# EAGLE design bmi088_proj_dgnfly (EAGLE 9.6.2)
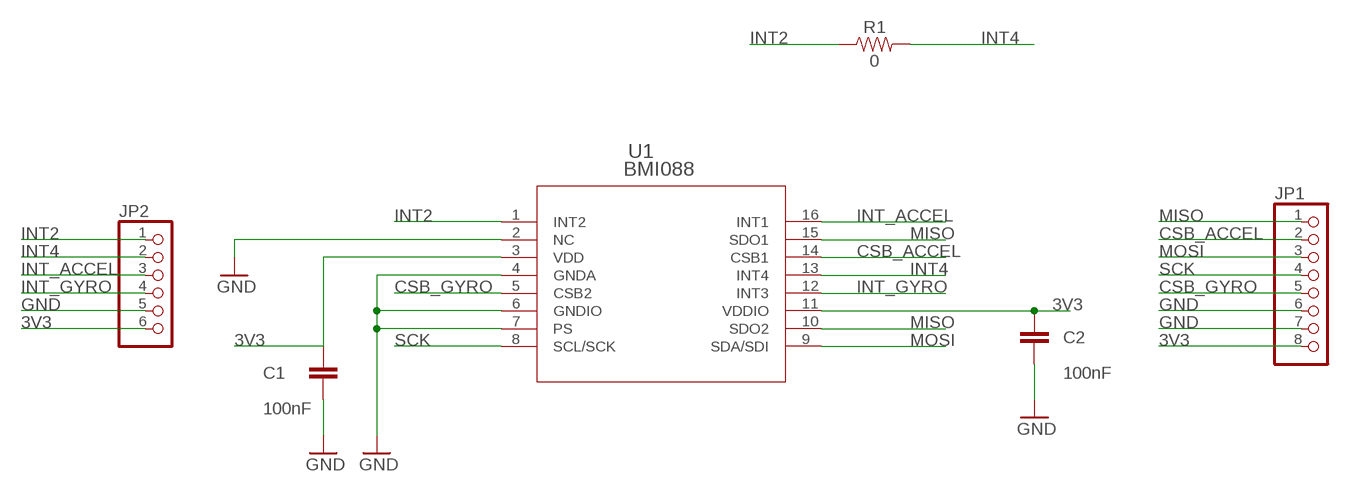
[diagram p0: schematic, sheet 1]

## Parts
C1  100nF  CC0402KRX7R7BB104  [CAPC1005X55N]
C2  100nF  CC0402KRX7R7BB104  [CAPC1005X55N]
JP1  PINHD-1X8  [1X08]
JP2  PINHD-1X6  [1X06]
R1  0  0OHM-0603-1/10W-5%  [0603]
U1  BMI088  [QFN_BMI085_BOS]

## Nets
3V3: C1.1 C2.1 JP1.8 JP2.6 U1.3(VDD) U1.11(VDDIO)
CSB_ACCEL: JP1.2 U1.14(CSB1)
CSB_GYRO: JP1.5 U1.5(CSB2)
GND: C1.2 C2.2 JP1.6 JP1.7 JP2.5 U1.2(NC) U1.4(GNDA) U1.6(GNDIO) U1.7(PS)
INT2: JP2.1 R1.1 U1.1(INT2)
INT4: JP2.2 R1.2 U1.13(INT4)
INT_ACCEL: JP2.3 U1.16(INT1)
INT_GYRO: JP2.4 U1.12(INT3)
MISO: JP1.1 U1.10(SDO2) U1.15(SDO1)
MOSI: JP1.3 U1.9(SDA/SDI)
SCK: JP1.4 U1.8(SCL/SCK)

## Library data of the parts
C1 C2 = ce-capstone:CC0402KRX7R7BB104: .1UF 16V 10% 0402; DESCRIPTION: 0.1µF ±10% 16V Ceramic Capacitor X7R 0402 _1005 Metric_; DIGI-KEY_PART_NUMBER: 311-1338-1-ND; DIGI-KEY_PURCHASE_URL: https://www.digikey.com/product-detail/en/yageo/CC0402KRX7R7BB104/311-1338-1-ND/2103122?utm_source=snapeda&utm_medium=aggregator&utm_campaign=symbol; MF: Yageo; MP: CC0402KRX7R7BB104; PACKAGE: 0402 Yageo
JP1 = pinhead:PINHD-1X8: PIN HEADER
JP2 = pinhead:PINHD-1X6: PIN HEADER
R1 = SparkFun-Resistors:0OHM: 0Ω resistor A resistor is a passive two-terminal electrical component that implements electrical resistance as a circuit element. Resistors act to reduce current flow, and, at the same time, act to lower voltage levels within circuits. - Wikipedia; PROD_ID: RES-08609
U1 = BMI088:BMI088; COPYRIGHT: Copyright (C) 2023 Ultra Librarian. All rights reserved.; MANUFACTURER_PART_NUMBER: BMI088; MFR_NAME: Bosch Sensortec

## Board
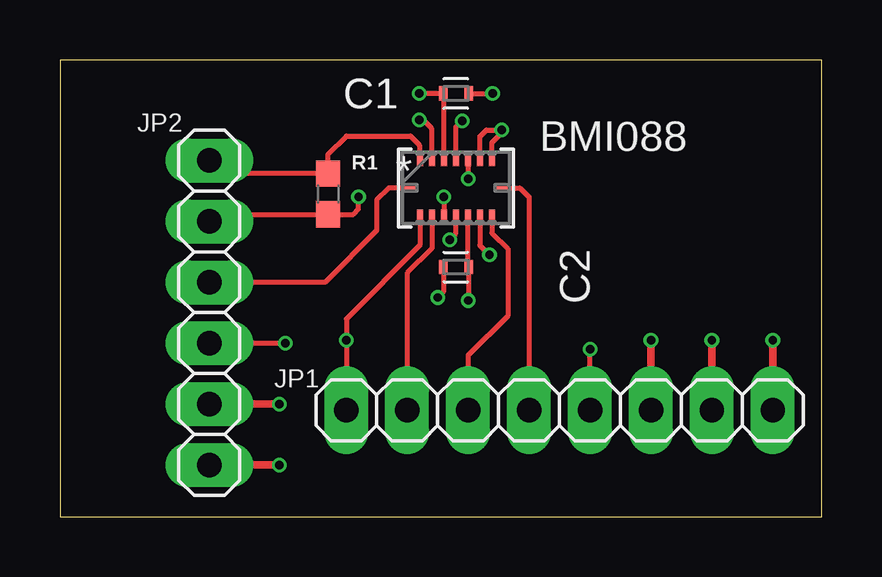
[diagram p1: board, top side]
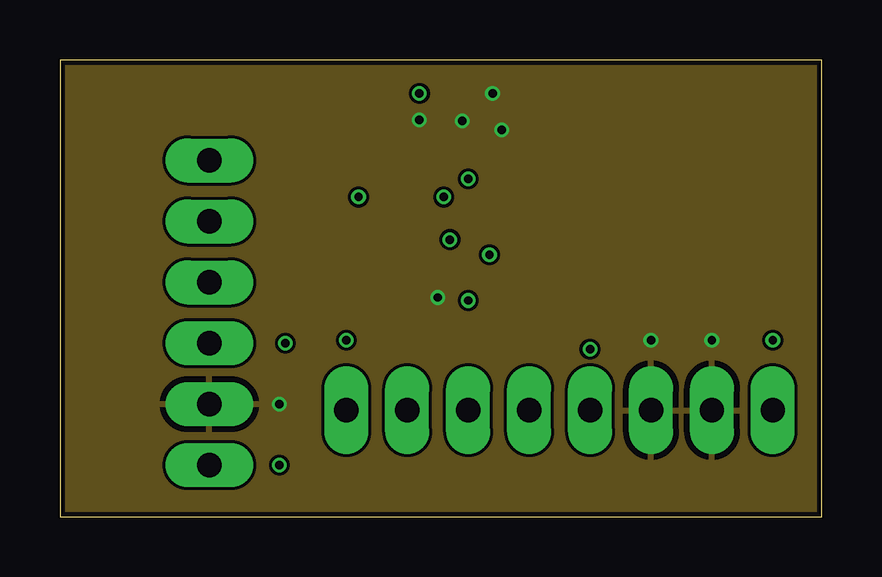
[diagram p2: board, inner layer Route2]
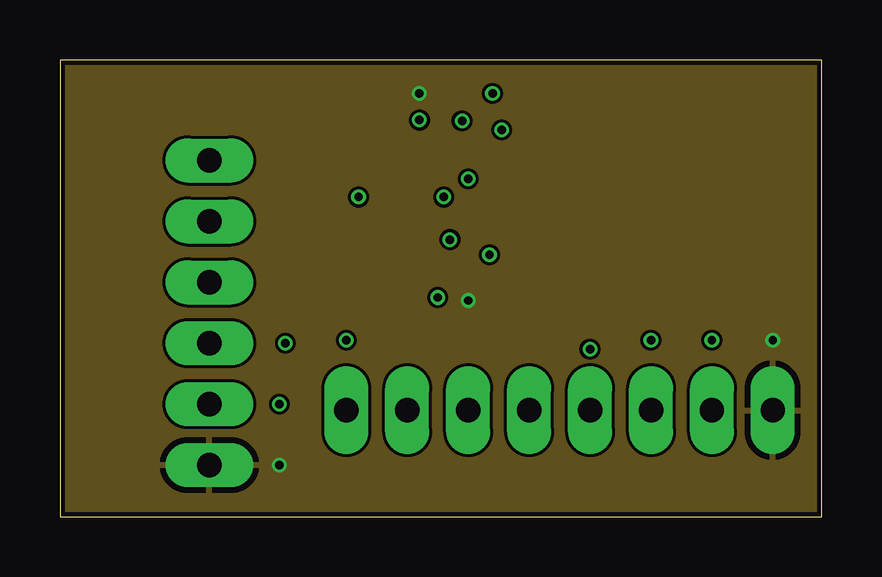
[diagram p3: board, inner layer Route15]
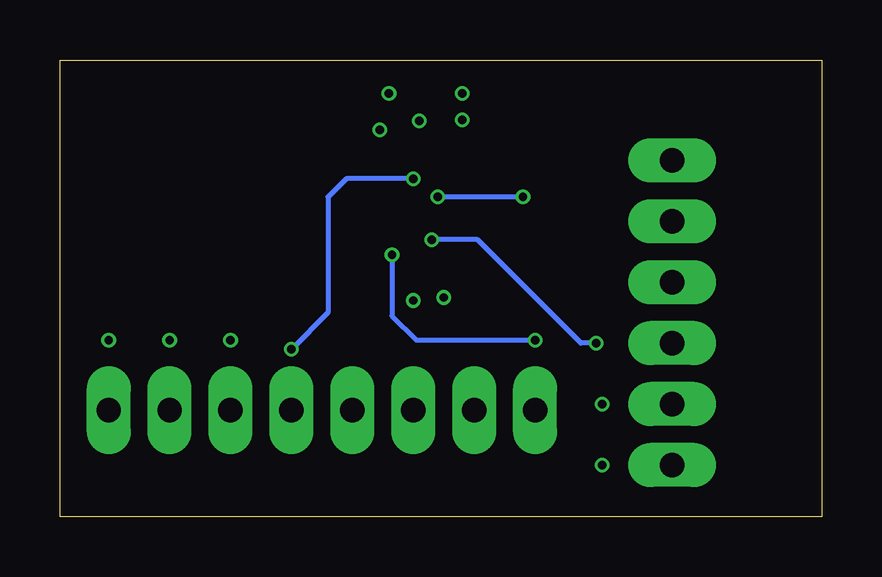
[diagram p4: board, bottom side, seen from below]

Size 31.75 x 19.05 mm. Coordinates in mm from the lower left corner, seen from the top.
Outline: 0,0 31.75,0 31.75,19.05 0,19.05 0,0
Copper layers (1+2*15+16): Top 0.035mm / dielectric 0.2mm / Route2 0.0175mm / dielectric 1.065mm / Route15 0.0175mm / dielectric 0.2mm / Bottom 0.035mm
Design rules "jlcpcb-4layers": minimum track width 3.5mil, minimum drill 0.2mm, track to track 5mil, track to pad 0.2mm, pad to pad 5mil, via to via 0.5mm, smd to smd 5mil, copper to edge 0.2mm, drill to drill 6mil, minimum pad ring 10mil, minimum via ring 0.13mm, stop-mask expansion 0.05mm, vias tented up to drill 16mil, thermal gap 10mil

### Footprints (pad centres in the part's own frame; a part is rotated, then mirrored left to right if it is on the bottom)
CAPC1005X55N = smd 0.35 x 0.6: 1 -0.525,0; 2 0.525,0
1X08 = drill 1.016 long: 1 -8.89,0; 2 -6.35,0; 3 -3.81,0; 4 -1.27,0; 5 1.27,0; 6 3.81,0; 7 6.35,0; 8 8.89,0
1X06 = drill 1.016 long: 1 -6.35,0; 2 -3.81,0; 3 -1.27,0; 4 1.27,0; 5 3.81,0; 6 6.35,0
0603 = smd 1.1 x 1: 1 -0.85,0; 2 0.85,0
QFN_BMI085_BOS = smd 0.254 x 0.483: 1 -1.5,1.156; 2 -1,1.156; 3 -0.5,1.156; 4 0,1.156; 5 0.5,1.156; 6 1,1.156; 7 1.5,1.156; 9 1.5,-1.156; 10 1,-1.156; 11 0.5,-1.156; 12 0,-1.156; 13 -0.5,-1.156; 14 -1,-1.156; 15 -1.5,-1.156 | smd 0.483 x 0.254: 8 1.911,0; 16 -1.911,0

### Placement (x,y rotation side)
C1  16.51,17.65 0 top
C2  16.51,10.41 180 top
JP1  20.83,4.45 0 top
JP2  6.22,8.51 270 top
R1  11.18,13.46 270 top
U1  16.51,13.72 0 top

### Tracks (layer width: path | path; a pad name or v marks a point on that pad's centre or on a via)
3V3  (via drill 0.35)
  Top 0.203: v14.99,17.65 C1.1 16.01,17.63 U1.3 | U1.11 17.01,10.41 C2.1 17.04,9.02 v17.02,9.02
  Top 0.305: JP2.6 v9.14,2.16 | JP1.8 v29.72,7.37
  pour Route15: 0.25,18.92 31.62,18.92 31.62,0.13 0.25,0.13
CSB_ACCEL
  Top 0.203: U1.14 15.51,11.19 14.48,10.16 JP1.2
CSB_GYRO  (via drill 0.35)
  Top 0.203: U1.5 v17.02,14.1 | JP1.5 v22.1,6.99
  Bottom 0.203: v17.02,14.1 19.81,14.1 20.57,13.34 20.57,8.51 v22.1,6.99
GND  (via drill 0.35)
  Top 0.203: C1.2 v18.03,17.65 | v14.99,16.54 15.15,16.54 15.51,16.18 U1.2 | U1.4 16.51,16.26 v16.76,16.51 | U1.6 17.51,15.86 17.78,16.13 v18.41,16.13 18.41,16 18.01,15.6 U1.7 | C2.2 15.98,9.38 v15.75,9.14
  Top 0.305: JP2.5 v9.14,4.7 | JP1.6 v24.64,7.37 | JP1.7 v27.18,7.37
  pour Route2: 0.25,18.92 31.62,18.92 31.62,0.13 0.25,0.13
INT2
  Top 0.203: U1.1 15.01,15.47 14.61,15.88 11.94,15.88 11.18,15.11 R1.1 6.77,14.31 JP2.1
INT4  (via drill 0.35)
  Top 0.203: JP2.2 6.52,12.61 R1.2 12.23,12.61 12.45,12.83 v12.45,13.34 | v16,13.34 16.01,13.33 U1.13
  Bottom 0.203: v12.45,13.34 v16,13.34
INT_ACCEL
  Top 0.203: U1.16 13.72,13.72 13.21,13.21 13.21,11.94 11.05,9.78 JP2.3
INT_GYRO  (via drill 0.35)
  Top 0.203: JP2.4 v9.4,7.24 | v16.26,11.56 16.51,11.81 U1.12
  Bottom 0.203: v9.4,7.24 10.03,7.24 14.35,11.56 v16.26,11.56
MISO  (via drill 0.35)
  Top 0.203: U1.15 15.01,11.33 11.94,8.26 v11.94,7.37 JP1.1 | U1.10 17.51,11.32 v17.91,10.92
  Bottom 0.203: v17.91,10.92 17.91,8.38 16.89,7.37 v11.94,7.37
MOSI
  Top 0.203: U1.9 18.01,11.84 18.67,11.18 18.67,8.38 17.02,6.73 JP1.3
SCK
  Top 0.203: U1.8 19.18,13.72 19.56,13.34 JP1.4